# EAGLE design Deska 2 (EAGLE 5.06)
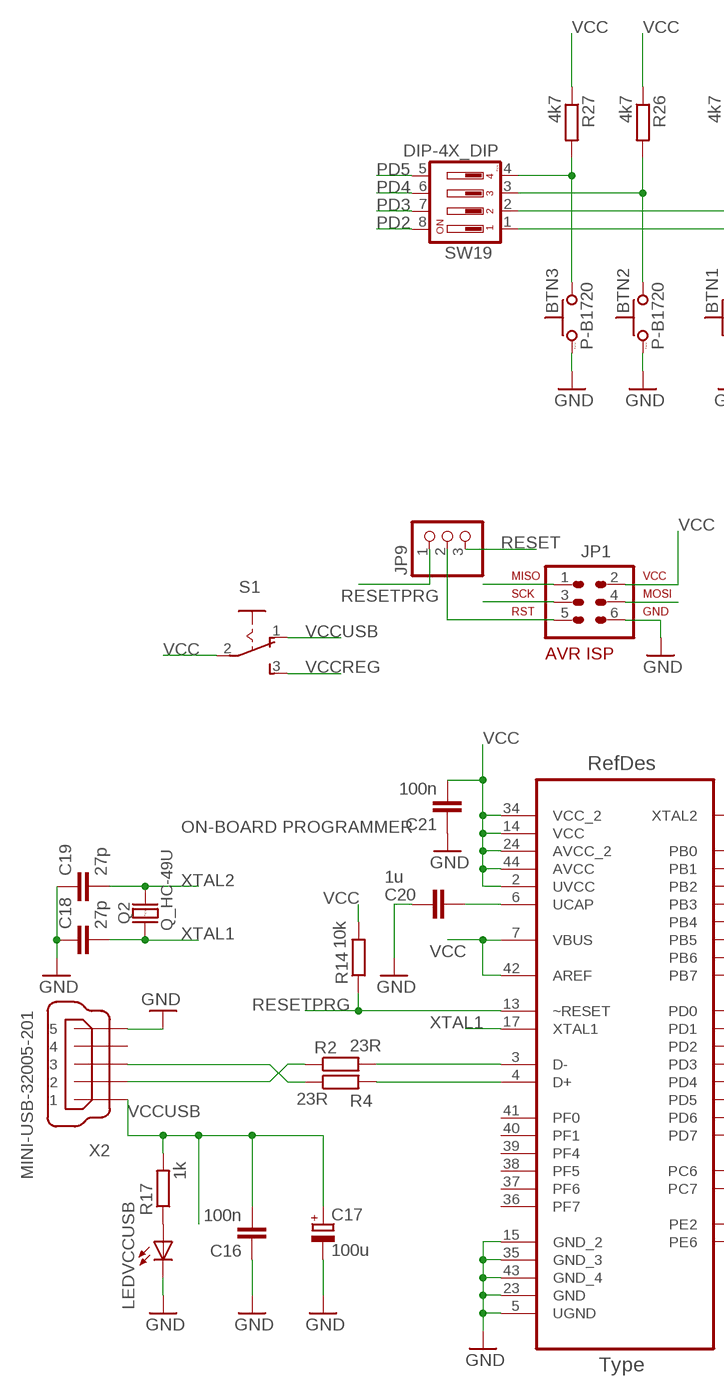
[diagram p0: schematic, sheet 1, part 1 of 2]
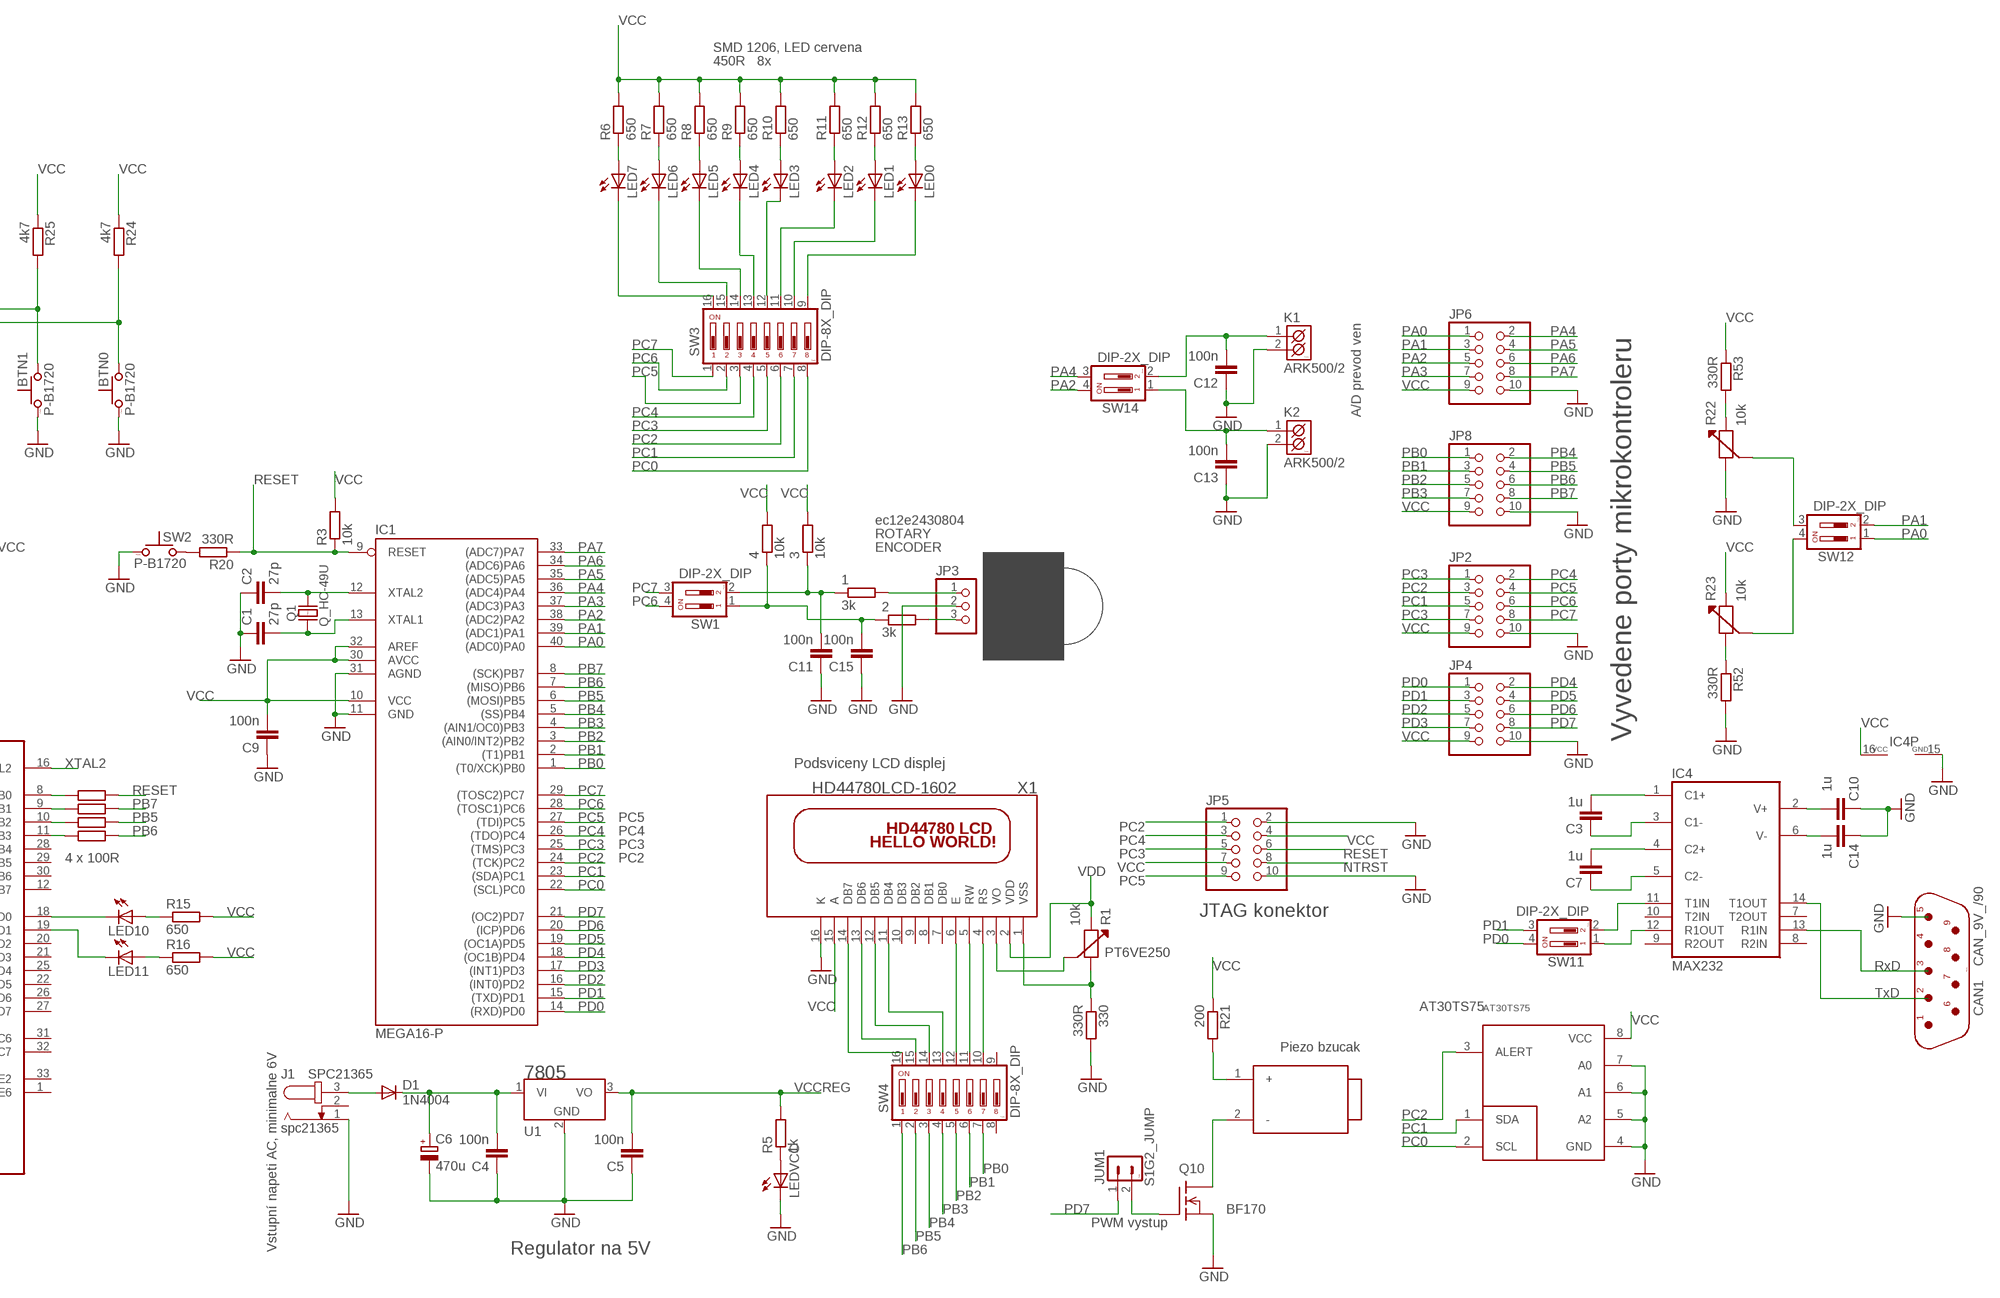
[diagram p1: schematic, sheet 1, part 2 of 2]

## Parts
1  3k  R-EU_M1206  [M1206]
2  3k  R-EU_M1206  [M1206]
3  10k  R-EU_M1206  [M1206]
4  10k  R-EU_M1206  [M1206]
5  100  R-EU_M1206  [M1206]
6  100  R-EU_M1206  [M1206]
7  100  R-EU_M1206  [M1206]
8  100  R-EU_M1206  [M1206]
330  330R  R-EU_M1206  [M1206]
BTN0  P-B1720  [P-B1720]
BTN1  P-B1720  [P-B1720]
BTN2  P-B1720  [P-B1720]
BTN3  P-B1720  [P-B1720]
C1  27p  C-EUC1206  [C1206]
C2  27p  C-EUC1206  [C1206]
C3  1u  C-EUC1206  [C1206]
C4  100n  C-EUC1206  [C1206]
C5  100n  C-EUC1206  [C1206]
C6  470u  CPOL-EUE2.5-7  [E2,5-7]
C7  1u  C-EUC1206  [C1206]
C9  100n  C-EUC1206  [C1206]
C10  1u  C-EUC1206  [C1206]
C11  100n  C-EUC1206  [C1206]
C12  100n  C-EUC1206  [C1206]
C13  100n  C-EUC1206  [C1206]
C14  1u  C-EUC1206  [C1206]
C15  100n  C-EUC1206  [C1206]
C16  100n  C-EUC1206  [C1206]
C17  100u  CPOL-EUE2.5-7  [E2,5-7]
C18  27p  C-EUC1206  [C1206]
C19  27p  C-EUC1206  [C1206]
C20  1u  C-EUC1206  [C1206]
C21  100n  C-EUC1206  [C1206]
CAN1  CAN_9V_/90  [CAN9V/90]
D1  1N4004  [DO41-10]
IC1  MEGA16-P  [DIL40]
IC4  MAX232  [DIL16]
J1  spc21365  JACK-PLUG1  [SPC4078]
JP1  AVR-ISP-6VERT  [AVR-ISP-6]
JP2  PINHD-2X5  [2X05]
JP3  PINHD-1X3  [1X03]
JP4  PINHD-2X5  [2X05]
JP5  PINHD-2X5  [2X05]
JP6  PINHD-2X5  [2X05]
JP8  PINHD-2X5  [2X05]
JP9  PINHD-1X3  [1X03]
JUM1  S1G2_JUMP  [S1G2_JUM]
K1  ARK500/2  [ARK500/2]
K2  ARK500/2  [ARK500/2]
KXG0905C  KXG0905C  [KXG0905C]
LED0  LEDSMT1206  [1206]
LED1  LEDSMT1206  [1206]
LED2  LEDSMT1206  [1206]
LED3  LEDSMT1206  [1206]
LED4  LEDSMT1206  [1206]
LED5  LEDSMT1206  [1206]
LED6  LEDSMT1206  [1206]
LED7  LEDSMT1206  [1206]
LED10  LEDSMT1206  [1206]
LED11  LEDSMT1206  [1206]
LEDVCC  LEDSMT1206  [1206]
LEDVCCUSB  LEDSMT1206  [1206]
Q1  Q_HC-49U  [HC-49U]
Q2  Q_HC-49U  [HC-49U]
Q10  BSS101  [TO92]
R1  10k  PT6V  [PT6V]
R2  23R  R-EU_M1206  [M1206]
R3  10k  R-EU_M1206  [M1206]
R4  23R  R-EU_M1206  [M1206]
R5  1k  R-EU_M1206  [M1206]
R6  650  R-EU_M1206  [M1206]
R7  650  R-EU_M1206  [M1206]
R8  650  R-EU_M1206  [M1206]
R9  650  R-EU_M1206  [M1206]
R10  650  R-EU_M1206  [M1206]
R11  650  R-EU_M1206  [M1206]
R12  650  R-EU_M1206  [M1206]
R13  650  R-EU_M1206  [M1206]
R14  10k  R-EU_M1206  [M1206]
R15  650  R-EU_M1206  [M1206]
R16  650  R-EU_M1206  [M1206]
R17  1k  R-EU_M1206  [M1206]
R20  330R  R-EU_M1206  [M1206]
R21  200  R-EU_M1206  [M1206]
R22  10k  PT6V  [PT6V]
R23  10k  PT6V  [PT6V]
R24  4k7  R-EU_M1206  [M1206]
R25  4k7  R-EU_M1206  [M1206]
R26  4k7  R-EU_M1206  [M1206]
R27  4k7  R-EU_M1206  [M1206]
R52  330R  R-EU_M1206  [M1206]
R53  330R  R-EU_M1206  [M1206]
S1  255SB  [255SB]
SW1  DIP-2X_DIP  [DIP-2X]
SW2  P-B1720  [P-B1720]
SW3  DIP-8X_DIP  [DIP-8X]
SW4  DIP-8X_DIP  [DIP-8X]
SW11  DIP-2X_DIP  [DIP-2X]
SW12  DIP-2X_DIP  [DIP-2X]
SW14  DIP-2X_DIP  [DIP-2X]
SW19  DIP-4X_DIP  [DIP-4X]
U1  7805  [TO-220S]
U2  ATMEGA16U4-AU  [QFP80P1200X1200X120-44N]
U$6  ATMEL_TEMP_SENSOR_AT30TS75  [SOIC8]
X1  HD44780LCD-1602  [LCD1602]
X2  MINI-USB-32005-201  [32005-201]

## Nets
GND: 330.2 BTN0.1 BTN1.1 BTN2.1 BTN3.1 C1.1 C2.1 C4.1 C5.1 C6.- C9.1 C10.1 C11.1 C12.1 C13.1 C14.1 C15.1 C16.1 C17.- C18.1 C19.1 C20.2 C21.1 CAN1.5 IC1.11(GND) IC1.31(AGND) IC4.15(GND) J1.1 JP1.6 JP2.10 JP3.2 JP4.10 JP5.2 JP5.10 JP6.10 JP8.10 K1.2(K2) K2.2(K2) LEDVCC.C LEDVCCUSB.C Q10.1(S) R22.1 R52.2 SW2.1 U1.2(GND) U2.5(UGND) U2.15(GND_2) U2.23(GND) U2.35(GND_3) U2.43(GND_4) U$6.4(GND) U$6.5(A2) U$6.6(A1) U$6.7(A0) X1.16(K) X2.5
N: JP1.5 JP9.2
N$1: R1.3 X1.3(VO)
N$2: C1.2 IC1.13(XTAL1) Q1.1
N$3: C2.2 IC1.12(XTAL2) Q1.2
N$4: SW4.16 X1.14(DB7)
N$5: SW4.15 X1.13(DB6)
N$6: SW4.14 X1.12(DB5)
N$7: SW4.13 X1.11(DB4)
N$8: SW4.12 X1.6(E)
N$9: SW4.11 X1.5(RW)
N$10: SW4.10 X1.4(RS)
N$11: 2.2 JP3.3
N$12: R2.2 U2.3(D-)
N$13: R2.1 X2.2
N$14: R4.1 X2.3
N$15: 2.1 4.1 C15.2 SW1.1
N$16: 1.1 3.1 C11.2 SW1.2
N$17: D1.A J1.3
N$18: C4.2 C6.+ D1.C U1.1(VI)
N$19: 1.2 JP3.1
N$20: R4.2 U2.4(D+)
N$21: LED10.C U2.18(PD0)
N$22: C20.1 U2.6(UCAP)
N$23: LED10.A R15.1
N$24: 5.1 U2.8(PB0)
N$25: 6.1 U2.9(PB1)
N$26: C12.2 K1.1(K1) SW14.2
N$27: LED11.A R16.1
N$28: LEDVCC.A R5.1
N$29: C13.2 K2.1(K1) SW14.1
N$30: LED3.C SW3.12
N$31: LED7.A R6.1
N$32: LED6.A R7.1
N$33: LED5.A R8.1
N$34: LED4.A R9.1
N$35: LED3.A R10.1
N$36: LED2.A R11.1
N$37: LED1.A R12.1
N$38: LED7.C SW3.16
N$39: LED6.C SW3.15
N$40: LED5.C SW3.14
N$41: LED4.C SW3.13
N$42: LED0.A R13.1
N$43: LED2.C SW3.11
N$44: LED1.C SW3.10
N$45: LED0.C SW3.9
N$46: IC4.12(R1OUT) SW11.1
N$47: C7.1 IC4.5(C2-)
N$48: C7.2 IC4.4(C2+)
N$49: C3.1 IC4.3(C1-)
N$50: C3.2 IC4.1(C1+)
N$51: C10.2 IC4.2(V+)
N$52: C14.2 IC4.6(V-)
N$53: BTN0.2 R24.2 SW19.1
N$54: BTN1.2 R25.2 SW19.2
N$55: BTN2.2 R26.2 SW19.3
N$56: BTN3.2 R27.2 SW19.4
N$57: R20.2 SW2.2
N$58: LED11.C U2.19(PD1)
N$59: 7.1 U2.10(PB2)
N$60: 8.1 U2.11(PB3)
N$61: LEDVCCUSB.A R17.1
N$63: U$6.3(ALERT)
N$114: JUM1.2 Q10.2(G)
N$116: KXG0905C.2(-) Q10.3(D)
N$120: KXG0905C.1(+) R21.2
N$122: IC4.11(T1IN) SW11.2
N$123: CAN1.2 IC4.14(T1OUT)
N$124: CAN1.3 IC4.13(R1IN)
N$125: R22.3 SW12.3
N$126: R23.3 SW12.4
N$131: R23.1 R52.1
N$132: R22.2 R53.2
NTRST: JP5.8
PA0: IC1.40((ADC0)PA0) JP6.1 SW12.1
PA1: IC1.39((ADC1)PA1) JP6.3 SW12.2
PA2: IC1.38((ADC2)PA2) JP6.5 SW14.4
PA3: IC1.37((ADC3)PA3) JP6.7
PA4: IC1.36((ADC4)PA4) JP6.2 SW14.3
PA5: IC1.35((ADC5)PA5) JP6.4
PA6: IC1.34((ADC6)PA6) JP6.6
PA7: IC1.33((ADC7)PA7) JP6.8
PB0: IC1.1((T0/XCK)PB0) JP8.1 SW4.7
PB1: IC1.2((T1)PB1) JP8.3 SW4.6
PB2: IC1.3((AIN0/INT2)PB2) JP8.5 SW4.5
PB3: IC1.4((AIN1/OC0)PB3) JP8.7 SW4.4
PB4: IC1.5((SS)PB4) JP8.2 SW4.3
PB5: 7.2 IC1.6((MOSI)PB5) JP1.4 JP8.4 SW4.2
PB6: 8.2 IC1.7((MISO)PB6) JP1.1 JP8.6 SW4.1
PB7: 6.2 IC1.8((SCK)PB7) JP1.3 JP8.8
PC0: IC1.22((SCL)PC0) JP2.7 SW3.8 U$6.2(SCL)
PC1: IC1.23((SDA)PC1) JP2.5 SW3.7 U$6.1(SDA)
PC2: IC1.24((TCK)PC2) JP2.3 JP5.1 SW3.6
PC3: IC1.25((TMS)PC3) JP2.1 JP5.5 SW3.5
PC4: IC1.26((TDO)PC4) JP2.2 JP5.3 SW3.4
PC5: IC1.27((TDI)PC5) JP2.4 JP5.9 SW3.3
PC6: IC1.28((TOSC1)PC6) JP2.6 SW1.4 SW3.2
PC7: IC1.29((TOSC2)PC7) JP2.8 SW1.3 SW3.1
PD0: IC1.14((RXD)PD0) JP4.1 SW11.4
PD1: IC1.15((TXD)PD1) JP4.3 SW11.3
PD2: IC1.16((INT0)PD2) JP4.5 SW19.8
PD3: IC1.17((INT1)PD3) JP4.7 SW19.7
PD4: IC1.18((OC1B)PD4) JP4.2 SW19.6
PD5: IC1.19((OC1A)PD5) JP4.4 SW19.5
PD6: IC1.20((ICP)PD6) JP4.6
PD7: IC1.21((OC2)PD7) JP4.8 JUM1.1
RESET: 5.2 IC1.9(RESET) JP5.6 JP9.3 R3.1 R20.1
RESETPRG: JP9.1 R14.1 U2.13(~RESET)
VCC: 3.2 4.2 C9.2 C21.2 IC1.10(VCC) IC1.30(AVCC) IC1.32(AREF) IC4.16(VCC) JP1.2 JP2.9 JP4.9 JP5.4 JP5.7 JP6.9 JP8.9 R3.2 R6.2 R7.2 R8.2 R9.2 R10.2 R11.2 R12.2 R13.2 R14.2 R15.2 R16.2 R21.1 R23.2 R24.1 R25.1 R26.1 R27.1 R53.1 S1.2(P) U2.2(UVCC) U2.7(VBUS) U2.14(VCC) U2.24(AVCC_2) U2.34(VCC_2) U2.42(AREF) U2.44(AVCC) U$6.8(VCC) X1.15(A)
VCCREG: C5.2 R5.2 S1.3(S) U1.3(VO)
VCCUSB: C16.2 C17.+ R17.2 S1.1(O) X2.1
VDD: R1.2 X1.2(VDD)
VSS: 330.1 R1.1 X1.1(VSS)
XTAL1: C18.2 Q2.1 U2.17(XTAL1)
XTAL2: C19.2 Q2.2 U2.16(XTAL2)
Unconnected: BTN0.3 BTN0.4 BTN1.3 BTN1.4 BTN2.3 BTN2.4 BTN3.3 BTN3.4 CAN1.1 CAN1.4 CAN1.6 CAN1.7 CAN1.8 CAN1.9 IC4.7(T2OUT) IC4.8(R2IN) IC4.9(R2OUT) IC4.10(T2IN) J1.2 SW2.3 SW2.4 SW4.8 SW4.9 U2.1(PE6) U2.12(PB7) U2.20(PD2) U2.21(PD3) U2.22(PD5) U2.25(PD4) U2.26(PD6) U2.27(PD7) U2.28(PB4) U2.29(PB5) U2.30(PB6) U2.31(PC6) U2.32(PC7) U2.33(PE2) U2.36(PF7) U2.37(PF6) U2.38(PF5) U2.39(PF4) U2.40(PF1) U2.41(PF0) X1.7(DB0) X1.8(DB1) X1.9(DB2) X1.10(DB3) X2.4

## Notes on the sheet
- SMD 1206, LED cervena
- 450R   8x
- A/D prevod ven
- ec12e2430804
- ROTARY
- ENCODER
- PC4
- PC5
- PC3
- Vyvedene porty mikrokontroleru
- Podsviceny LCD displej
- ON-BOARD PROGRAMMER
- PC5
- PC4
- PC3
- 4 x 100R | PC2
- JTAG konektor
- PT6VE250
- RxD
- TxD
- AT30TS75
- Vstupní napeti AC, minimalne 6V | Piezo bzucak
- SPC21365 | 7805
- BF170
- PWM vystup
- Regulator na 5V

## Library data of the parts
1-8 330 R2-R17 R20 R21 R24-R27 R52 R53 = resistor:R-EU_: RESISTOR, European symbol
BTN0 BTN1-BTN3 SW2 = #PaJa_prepinace:P-B1720: µ-tlacitko
C1-C5 C7 C9-C16 C18-C21 = resistor:C-EU: CAPACITOR, European symbol
C6 C17 = resistor:CPOL-EU: POLARIZED CAPACITOR, European symbol
CAN1 = #PaJa_konektory:CAN_9V: Konektory CANNON - vidlice - 9pinu
D1 = adafruit:1N4004: DIODE General purpose 1N400x type rectifier (With bigger pads) http://www.ladyada.net/library/pcb/eaglelibrary.html
IC1 = avr-7:MEGA16-P: MICROCONTROLLER 16 Kbytes FLASH 1 kbytes SRAM 512 bytes EEPROM USART 8-channel 10 bit ADC
IC4 = maxim:MAX232: RS232 TRANSEIVER
J1 = con-jack:JACK-PLUG: DC POWER JACK Power Jack, DC, Right Angle, Through Hole, Rated 5A at 16VDC, PC Terminals Distributor: Farnell (www.Farnell.de) Drawing: 84N1161.pdf / 84N1162.pdf Manufacturer: SPC Technology (www.spctechnology.com) Type: SPC4077 / SPC 4078
JP1 = avr-7:AVR-ISP-6: AVR ISP-6 Serial Programming Header
JP2 JP4-JP6 JP8 = pinhead:PINHD-2X5: PIN HEADER
JP3 JP9 = pinhead:PINHD-1X3: PIN HEADER
JUM1 = #PaJa_konektory:S1G2_JUMP: Radove konektory - koliky - 2x
K1 K2 = #PaJa_konektory:ARK500/2: Svorkovnice - roztec 5mm - dvojita
KXG0905C = piezo2:KXG0905C
LED0 LED1-LED7 LED10 LED11 LEDVCC LEDVCCUSB = led:LED: LED OSRAM: - CHIPLED LG R971, LG N971, LY N971, LG Q971, LY Q971, LO R971, LY R971 LH N974, LH R974 LS Q976, LO Q976, LY Q976 LO Q996 - Hyper CHIPLED LW Q18S LB Q993, LB Q99A, LB R99A - SideLED LS A670, LO A670, LY A670, LG A670, LP A670 LB A673, LV A673, LT A673, LW A673 LH A674 LY A675 LS A676, LA A676, LO A676, LY A676, LW A676 LS A679, LY A679, LG A679 - Hyper Micro SIDELED® LS Y876, LA Y876, LO Y876, LY Y876 LT Y87S - SmartLED LW L88C, LW L88S LB L89C, LB L89S, LG L890 LS L89K, LO L89K, LY L89K LS L896, LA L896, LO L896, LY L896 - TOPLED LS T670, LO T670, LY T670, LG T670, LP T670 LSG T670, LSP T670, LSY T670, LOP T670, LYG T670 LG T671, LOG T671, LSG T671 LB T673, LV T673, LT T673, LW T673 LH T674 LS T676, LA T676, LO T676, LY T676, LB T676, LH T676, LSB T676, LW T676 LB T67C, LV T67C, LT T67C, LS T67K, LO T67K, LY T67K, LW E67C LS E67B, LA E67B, LO E67B, LY E67B, LB E67C, LV E67C, LT E67C LW T67C LS T679, LY T679, LG T679 LS T770, LO T770, LY T770, LG T770, LP T770 LB T773, LV T773, LT T773, LW T773 LH T774 LS E675, LA E675, LY E675, LS T675 LS T776, LA T776, LO T776, LY T776, LB T776 LHGB T686 LT T68C, LB T68C - Hyper Mini TOPLED® LB M676 - Mini TOPLED Santana® LG M470 LS M47K, LO M47K, LY M47K Source: http://www.osram.convergy.de LUXEON: - LUMILED® LXK2-PW12-R00, LXK2-PW12-S00, LXK2-PW14-U00, LXK2-PW14-V00 LXK2-PM12-R00, LXK2-PM12-S00, LXK2-PM14-U00 LXK2-PE12-Q00, LXK2-PE12-R00, LXK2-PE12-S00, LXK2-PE14-T00, LXK2-PE14-U00 LXK2-PB12-K00, LXK2-PB12-L00, LXK2-PB12-M00, LXK2-PB14-N00, LXK2-PB14-P00, LXK2-PB14-Q00 LXK2-PR12-L00, LXK2-PR12-M00, LXK2-PR14-Q00, LXK2-PR14-R00 LXK2-PD12-Q00, LXK2-PD12-R00, LXK2-PD12-S00 LXK2-PH12-R00, LXK2-PH12-S00 LXK2-PL12-P00, LXK2-PL12-Q00, LXK2-PL12-R00 Source: www.luxeon.com KINGBRIGHT: KA-3528ASYC Source: www.kingbright.com
Q1 Q2 = #PaJa_22:Q_HC-49U: Krystal - 1MHz - 48MHz
Q10 = transistor-fet:BSS101: N-Channel Enhancement MOSFET 200V; 0,16A; 11Ohm
R1 R22 R23 = #_GM99:PT6V
S1 = switch:255SB: SLIDING SWITCH Distributor Buerklin, 11G810
SW1 SW11 SW12 SW14 = #PaJa_prepinace:DIP-2X: DIP Prepinac - 2x
SW3 SW4 = #PaJa_prepinace:DIP-8X: DIP Prepinac - 8x
SW19 = #PaJa_prepinace:DIP-4X: DIP Prepinac - 4x
U1 = #_GM99:7805
U2 = atmega16u4:ATMEGA16U4-AU; DESCRIPTION: Microcontroller with USB Controller; MPN: ATMEGA16U4-AU; OC_FARNELL: 1748521; OC_NEWARK: 26R5623; PACKAGE: TQFP-44; SUPPLIER: Atmel
U$6 = AT30TS75:ATMEL_TEMP_SENSOR_AT30TS75: Temperature sensor I2C
X1 = adafruit:HD44780LCD: HD44780 LCD Standard character type LCDs, available in sizes from 8x1 to 40x4!
X2 = con-cypressindustries:MINI-USB-: MINI USB-B Conector Source: www.cypressindustries.com

## Board
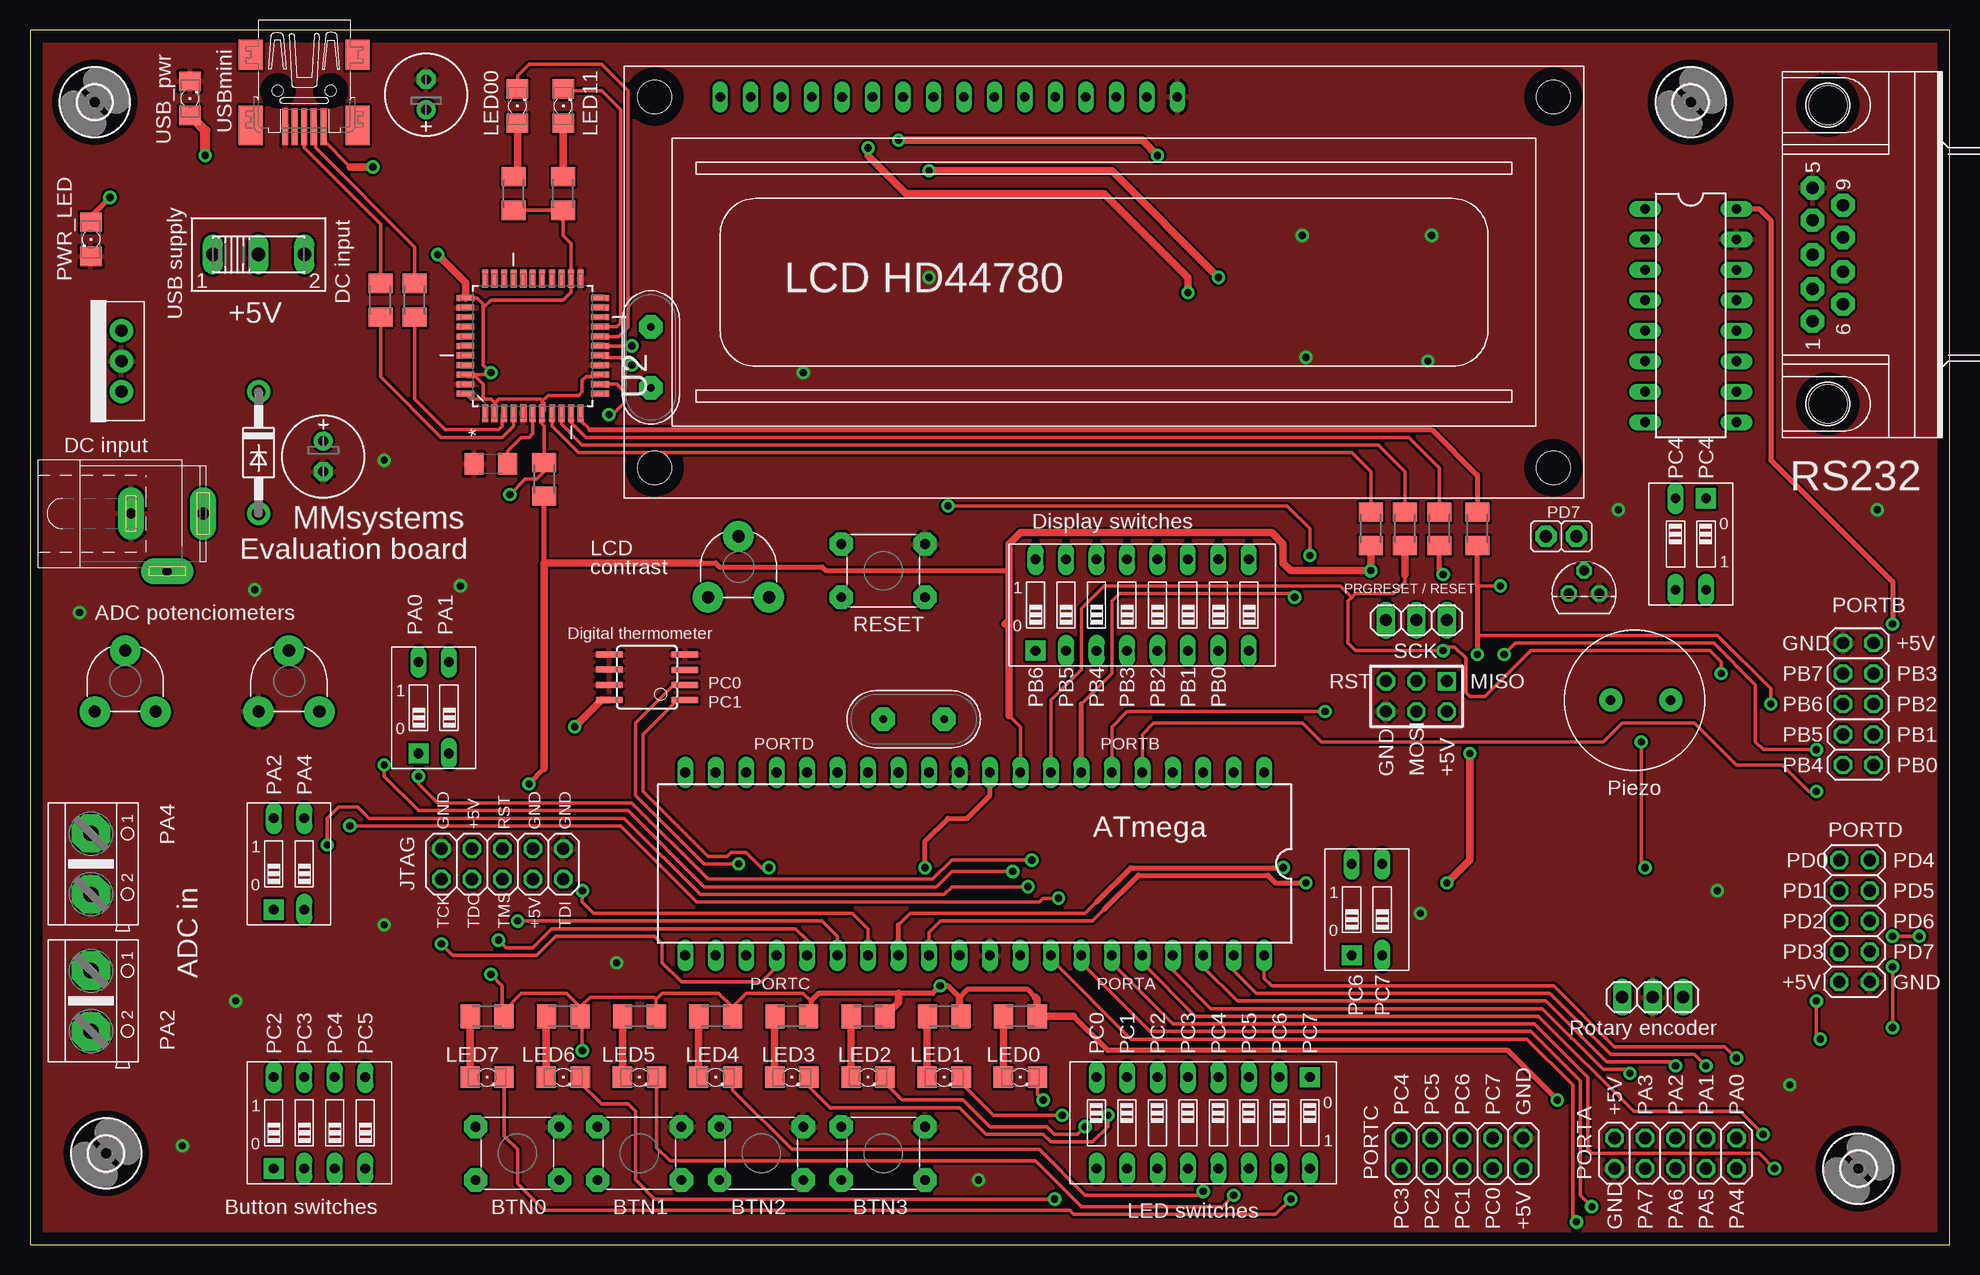
[diagram p2: board, top side]
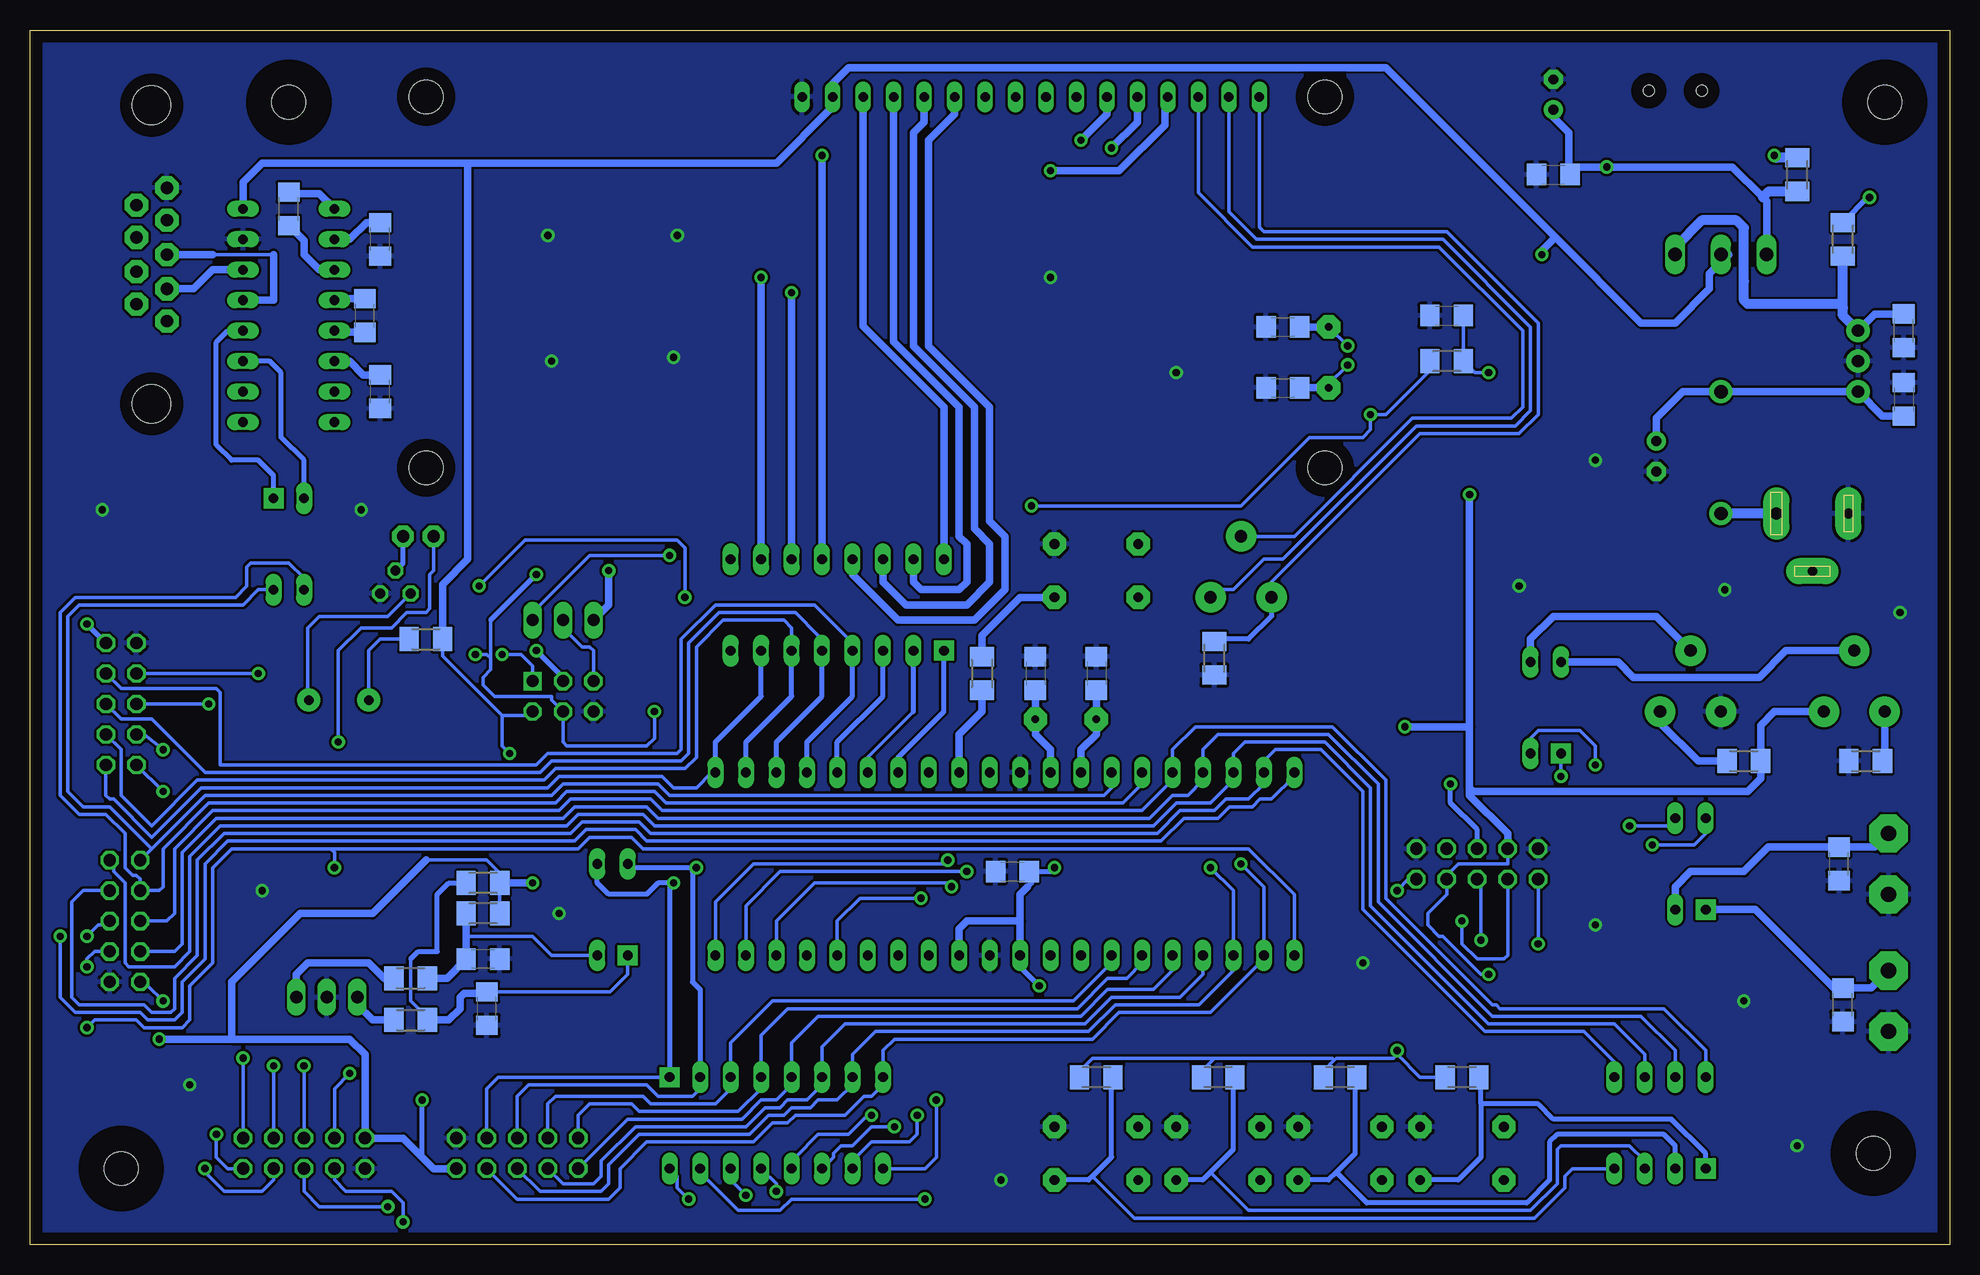
[diagram p3: board, bottom side, seen from below]

Size 160 x 101.27 mm. Coordinates in mm from the lower left corner, seen from the top.
Outline: 0,0 160,0 160,101.27 0,101.27 0,0
Copper layers (1*16): Top 0.035mm / dielectric 1.5mm / Bottom 0.035mm
Design rules "default *": minimum track width 10mil, minimum drill 24mil, track to track 8mil, track to pad 8mil, pad to pad 8mil, via to via 8mil, smd to smd 8mil, copper to edge 40mil, drill to drill 8mil, minimum pad ring 10mil, minimum via ring 10mil, stop-mask expansion 4mil, vias tented up to drill 0mil, thermal gap 10mil

### Footprints (pad centres in the part's own frame; a part is rotated, then mirrored left to right if it is on the bottom)
M1206 = smd 1.6 x 2: 1 -1.4,0; 2 1.4,0
P-B1720 = drill 0.813 pad 1.93 octagon: 1 -3.493,-2.223; 2 -3.493,2.223; 3 3.493,-2.223; 4 3.493,2.223
C1206 = smd 1.6 x 1.8: 1 -1.4,0; 2 1.4,0
E2,5-7 = drill 0.813 pad 1.6 round: + -1.27,0 | drill 0.813 pad 1.6 octagon: - 1.27,0
CAN9V/90 = drill 1.016 pad 1.93 octagon: 1 5.556,0; 2 2.857,0; 3 0,0; 4 -2.857,0; 5 -5.556,0; 6 4.128,2.54; 7 1.429,2.54; 8 -1.429,2.54; 9 -4.128,2.54 | hole 3.2: 12.446,1.27; -12.446,1.27
DO41-10 = drill 1.118 pad 1.93 round: A 5.08,0; C -5.08,0
DIL40 = drill 0.813 long: 1 -24.13,-7.62; 2 -21.59,-7.62; 3 -19.05,-7.62; 4 -16.51,-7.62; 5 -13.97,-7.62; 6 -11.43,-7.62; 7 -8.89,-7.62; 8 -6.35,-7.62; 9 -3.81,-7.62; 10 -1.27,-7.62; 11 1.27,-7.62; 12 3.81,-7.62; 13 6.35,-7.62; 14 8.89,-7.62; 15 11.43,-7.62; 16 13.97,-7.62; 17 16.51,-7.62; 18 19.05,-7.62; 19 21.59,-7.62; 20 24.13,-7.62; 21 24.13,7.62; 22 21.59,7.62; 23 19.05,7.62; 24 16.51,7.62; 25 13.97,7.62; 26 11.43,7.62; 27 8.89,7.62; 28 6.35,7.62; 29 3.81,7.62; 30 1.27,7.62; 31 -1.27,7.62; 32 -3.81,7.62; 33 -6.35,7.62; 34 -8.89,7.62; 35 -11.43,7.62; 36 -13.97,7.62; 37 -16.51,7.62; 38 -19.05,7.62; 39 -21.59,7.62; 40 -24.13,7.62
DIL16 = drill 0.813 long: 1 -8.89,-3.81; 2 -6.35,-3.81; 3 -3.81,-3.81; 4 -1.27,-3.81; 5 1.27,-3.81; 6 3.81,-3.81; 7 6.35,-3.81; 8 8.89,-3.81; 9 8.89,3.81; 10 6.35,3.81; 11 3.81,3.81; 12 1.27,3.81; 13 -1.27,3.81; 14 -3.81,3.81; 15 -6.35,3.81; 16 -8.89,3.81
SPC4078 = drill 0.8 pad 2.184 long: 1 -3,0; 2 0,-4.8 | drill 1 pad 2.184 long: 3 3,0
AVR-ISP-6 = drill 1.016 square: 1 -2.54,-1.27 | drill 1.016 octagon: 2 -2.54,1.27; 3 0,-1.27; 4 0,1.27; 5 2.54,-1.27; 6 2.54,1.27
2X05 = drill 1.016 octagon: 1 -5.08,-1.27; 2 -5.08,1.27; 3 -2.54,-1.27; 4 -2.54,1.27; 5 0,-1.27; 6 0,1.27; 7 2.54,-1.27; 8 2.54,1.27; 9 5.08,-1.27; 10 5.08,1.27
1X03 = drill 1.016 long: 1 -2.54,0; 2 0,0; 3 2.54,0
S1G2_JUM = drill 1.016 pad 1.778 octagon: 1 -1.27,0; 2 1.27,0
ARK500/2 = drill 1.27 pad 3.2 octagon: 1 -2.54,0; 2 2.54,0
KXG0905C = drill 0.8 pad 1.93 round: 1 0,0; 2 5,0
1206 = smd 1.6 x 1.803: A -1.422,0; C 1.422,0
HC-49U = drill 0.61 pad 1.93 octagon: 1 -2.54,0; 2 2.54,0
TO92 = drill 0.813 octagon: 1 1.27,0; 2 0,1.905; 3 -1.27,0
PT6V = drill 1.016 pad 2.54 round: 1 0,0; 2 5.08,0; 3 2.54,5.08
255SB = drill 1.118 long: 1 -3.81,0; 2 0,0; 3 3.81,0
DIP-2X = drill 0.813 pad 1.676 square: 1 -1.27,-3.81 | drill 0.813 pad 1.27 long: 2 1.27,-3.81; 3 1.27,3.81; 4 -1.27,3.81
DIP-8X = drill 0.813 pad 1.676 square: 1 -8.89,-3.81 | drill 0.813 pad 1.27 long: 2 -6.35,-3.81; 3 -3.81,-3.81; 4 -1.27,-3.81; 5 1.27,-3.81; 6 3.81,-3.81; 7 6.35,-3.81; 8 8.89,-3.81; 9 8.89,3.81; 10 6.35,3.81; 11 3.81,3.81; 12 1.27,3.81; 13 -1.27,3.81; 14 -3.81,3.81; 15 -6.35,3.81; 16 -8.89,3.81
DIP-4X = drill 0.813 pad 1.676 square: 1 -3.81,-3.81 | drill 0.813 pad 1.27 long: 2 -1.27,-3.81; 3 1.27,-3.81; 4 3.81,-3.81; 5 3.81,3.81; 6 1.27,3.81; 7 -1.27,3.81; 8 -3.81,3.81
TO-220S = drill 1.016 pad 1.93 round: 1 0,0; 2 2.54,0; 3 5.08,0
QFP80P1200X1200X120-44N = smd 1.473 x 0.508: 1 -5.613,3.988; 2 -5.613,3.2; 3 -5.613,2.388; 4 -5.613,1.6; 5 -5.613,0.787; 6 -5.613,0; 7 -5.613,-0.787; 8 -5.613,-1.6; 9 -5.613,-2.388; 10 -5.613,-3.2; 11 -5.613,-3.988; 23 5.613,-3.988; 24 5.613,-3.2; 25 5.613,-2.388; 26 5.613,-1.6; 27 5.613,-0.787; 28 5.613,0; 29 5.613,0.787; 30 5.613,1.6; 31 5.613,2.388; 32 5.613,3.2; 33 5.613,3.988 | smd 0.508 x 1.473: 12 -3.988,-5.613; 13 -3.2,-5.613; 14 -2.388,-5.613; 15 -1.6,-5.613; 16 -0.787,-5.613; 17 0,-5.613; 18 0.787,-5.613; 19 1.6,-5.613; 20 2.388,-5.613; 21 3.2,-5.613; 22 3.988,-5.613; 34 3.988,5.613; 35 3.2,5.613; 36 2.388,5.613; 37 1.6,5.613; 38 0.787,5.613; 39 0,5.613; 40 -0.787,5.613; 41 -1.6,5.613; 42 -2.388,5.613; 43 -3.2,5.613; 44 -3.988,5.613
2,8 = hole 2.8: 0,0
SOIC8 = smd 0.5 x 2.2: 1 -1.905,-3.154; 2 -0.645,-3.154; 3 0.625,-3.154; 4 1.895,-3.154; 5 1.905,3.154; 6 0.635,3.154; 7 -0.635,3.154; 8 -1.905,3.154
LCD1602 = drill 0.8 long: 1 8,33.46; 2 10.54,33.46; 3 13.08,33.46; 4 15.62,33.46; 5 18.16,33.46; 6 20.7,33.46; 7 23.24,33.46; 8 25.78,33.46; 9 28.32,33.46; 10 30.86,33.46; 11 33.4,33.46; 12 35.94,33.46; 13 38.48,33.46; 14 41.02,33.46; 15 43.56,33.46; 16 46.1,33.46 | hole 2.8: 2.54,2.54; 2.54,33.46; 77.46,33.46; 77.46,2.54
32005-201 = smd 3.1 x 0.5: 1 3,1.6; 2 3,0.8; 3 3,0; 4 3,-0.8; 5 3,-1.6 | smd 2.5 x 2: M1 -3,-4.45; M2 -3,4.45 | smd 3.3 x 2: M3 2.9,4.45; M4 2.9,-4.45 | hole 0.9: 0,2.2; 0,-2.2

### Placement (x,y rotation side)
1  128.27,22.23 180 bottom
2  128.27,18.73 180 bottom
3  122.24,27.62 0 bottom
4  122.24,30.16 0 bottom
5  111.76,59.69 270 top
6  114.62,59.69 270 top
7  117.47,59.69 270 top
8  120.65,59.69 270 top
330  61.28,48.9 270 bottom
BTN0  40.64,7.62 180 top
BTN1  50.8,7.62 180 top
BTN2  60.96,7.62 180 top
BTN3  71.12,7.62 180 top
C1  71.12,47.62 270 bottom
C2  76.2,47.62 270 bottom
C3  138.43,86.36 90 bottom
C4  3.81,70.48 270 bottom
C5  3.81,76.2 90 bottom
C6  24.45,65.72 270 top
C7  132.08,77.47 90 bottom
C9  78.11,31.11 0 bottom
C10  130.81,83.82 90 bottom
C11  122.24,23.81 180 bottom
C12  9.21,31.75 90 bottom
C13  8.89,20 90 bottom
C14  130.81,71.12 90 bottom
C15  121.92,19.68 90 bottom
C16  33.02,89.22 0 bottom
C17  33.02,95.89 90 top
C18  55.56,76.52 0 bottom
C19  55.56,71.44 0 bottom
C20  38.42,65.09 180 top
C21  41.91,77.47 0 bottom
CAN1  148.59,82.55 270 top
D1  19.05,66.04 270 top
IC1  78.74,31.75 180 top
IC4  138.43,77.47 270 top
J1  11.43,60.96 0 top
JP1  115.57,45.72 180 top
JP2  119.38,7.62 0 top
JP3  135.25,20.64 180 top
JP4  152.08,26.99 270 top
JP5  39.37,31.75 0 top
JP6  137.16,7.62 180 top
JP8  152.4,45.09 90 top
JP9  115.57,52.07 180 top
JUM1  127.64,59.05 0 top
K1  5.08,31.75 270 top
K2  5.08,20.32 270 top
KXG0905C  131.76,45.4 0 top
LED0  82.55,13.97 0 top
LED1  76.2,13.97 0 top
LED2  69.85,13.97 0 top
LED3  63.5,13.97 0 top
LED4  57.15,13.97 0 top
LED5  50.8,13.97 0 top
LED6  44.45,13.97 0 top
LED7  38.1,13.97 0 top
LED10  40.64,94.93 90 top
LED11  44.45,94.93 90 top
LEDVCC  5.08,83.82 270 top
LEDVCCUSB  13.34,95.57 90 top
Q1  73.66,43.81 0 top
Q2  51.75,73.98 270 top
Q10  129.54,54.29 0 top
R1  56.52,53.98 0 top
R2  32.07,78.74 270 top
R3  42.86,63.82 90 top
R4  29.21,78.74 270 top
R5  8.89,83.82 270 bottom
R6  38.1,19.05 0 top
R7  44.45,19.05 0 top
R8  50.8,19.05 0 top
R9  57.15,19.05 0 top
R10  63.5,19.05 0 top
R11  69.85,19.05 0 top
R12  76.2,19.05 0 top
R13  82.55,19.05 0 top
R14  41.91,73.66 0 bottom
R15  40.32,87.63 270 top
R16  44.45,87.63 270 top
R17  12.7,89.22 270 bottom
R20  80.64,47.62 90 bottom
R21  127,50.48 180 bottom
R22  19.05,44.45 0 top
R23  5.4,44.45 0 top
R24  40.64,13.97 0 bottom
R25  50.8,13.97 0 bottom
R26  60.96,13.97 0 bottom
R27  71.12,13.97 0 bottom
R52  6.99,40.32 180 bottom
R53  17.14,40.32 180 bottom
S1  19.05,82.55 0 top
SW1  111.44,27.94 0 top
SW2  71.12,56.2 180 top
SW3  97.79,10.16 180 top
SW4  92.71,53.34 0 top
SW11  138.43,58.42 180 top
SW12  33.66,44.77 0 top
SW14  21.59,31.75 0 top
SW19  24.13,10.16 0 top
U1  7.62,71.12 90 top
U2  41.91,74.93 90 top
U$2  [2,8]  138.43,95.25 0 top
U$3  [2,8]  152.4,6.35 0 top
U$4  [2,8]  6.35,7.62 0 top
U$5  [2,8]  5.4,95.25 0 top
U$6  51.44,47.31 90 top
X1  49.53,62.23 0 top
X2  22.86,96.2 270 top

### Tracks (layer width: path | path; a pad name or v marks a point on that pad's centre or on a via)
GND  (via drill 0.6)
  other vias: 29.53,65.41 35.88,54.93 18.73,54.61 4.13,52.7 29.53,26.67 17.14,20.32 12.7,8.26 48.9,23.5 79.06,5.4 115.89,27.62 146.69,13.34 140.65,29.53 132.4,61.28 153.99,61.28 116.84,84.14 106.05,84.14 106.36,73.98 116.52,73.66 74.93,80.64 64.45,72.71
  pour Top: 0,0 160.02,0 160.02,101.28 0,101.28
  pour Bottom: 0,0 160.02,0 160.02,101.28 0,101.28
N
  Bottom 0.305: JP9.2 115.57,51.44 113.98,49.85 113.35,49.85 113.03,49.53 JP1.5
N$1
  Bottom 0.305: X1.3 62.61,87.69 58.1,83.19 42.55,83.19 35.56,76.2 35.56,69.85 36.51,68.9 44.77,68.9 54.61,59.05 R1.3
N$2
  Bottom 0.61: IC1.13 72.39,41.27 71.12,42.55 Q1.1 C1.2
N$3
  Bottom 0.61: IC1.12 74.93,41.27 76.2,42.55 Q1.2 C2.2
N$4
  Bottom 0.61: X1.14 90.55,76.58 83.82,69.85 SW4.16
N$5
  Bottom 0.61: X1.13 88.01,75.31 82.55,69.85 82.55,59.05 81.92,58.42 81.92,55.24 82.55,54.61 85.72,54.61 86.36,55.24 SW4.15
N$6
  Bottom 0.61: X1.12 85.47,93.6 86.36,92.71 86.36,74.93 81.28,69.85 81.28,59.69 80.01,58.42 80.01,55.24 81.92,53.34 87,53.34 88.9,55.24 SW4.14
N$7
  Bottom 0.61: X1.11 82.93,94.23 85.09,92.08 85.09,74.93 80.01,69.85 80.01,60.33 78.74,59.05 78.74,54.61 81.28,52.07 87.63,52.07 91.44,55.88 SW4.13
N$8  (via drill 0.6 pad 0.41)
  Top 0.61: v93.98,90.81 92.71,92.08 v72.39,92.08
  Bottom 0.61: SW4.12 v93.98,90.81 | v72.39,92.08 70.23,94.23 X1.6
N$9  (via drill 0.6 pad 0.41)
  Top 0.61: v96.52,79.38 96.52,80.64 89.53,87.63 73.03,87.63 69.85,90.81 v69.85,91.44
  Bottom 0.61: SW4.11 v96.52,79.38 | v69.85,91.44 67.69,93.6 X1.5
N$10  (via drill 0.6 pad 0.41)
  Top 0.61: v99.06,80.64 90.17,89.53 v74.93,89.53
  Bottom 0.61: SW4.10 v99.06,80.64 | v74.93,89.53 69.22,89.53 65.41,93.34 65.41,95.44 X1.4
N$11
  Bottom 0.61: 2.2 131.44,18.73 132.72,20 JP3.3
N$12
  Top 0.305: R2.2 32.07,70.48 34.61,67.94 39.05,67.94 39.37,68.26 39.37,69.16 U2.3
N$13
  Top 0.305: X2.2 23.81,93.37 23.81,91.44 32.07,83.19 R2.1
N$14
  Top 0.305: X2.3 22.86,91.44 29.21,85.09 R4.1
N$15
  Bottom 0.305: 2.1 126.87,18.92 128.27,20.32 128.27,23.81 | C15.2 111.63,21.09 110.17,22.54 SW1.1
  Bottom 0.406: 128.27,23.81 127.64,24.45 126.05,24.45 126.05,29.21 125.09,30.16 4.1
  Bottom 0.61: 2.1 125.09,18.73 124.14,19.68 124.14,20.64 123.83,20.95 122.05,20.95 C15.2
N$16
  Bottom 0.305: C11.2 123.64,24.95 123.51,25.08 | SW1.2 116.52,24.13 118.11,25.72 123.64,25.72
  Bottom 0.61: 1.1 125.22,22.23 C11.2 123.64,25.72 3.1
N$17
  Bottom 0.813: J1.3 D1.A
N$18
  Bottom 0.61: C4.2 5.58,69.08 U1.1 D1.C 22.23,71.12 24.45,68.9 C6.+
N$19
  Bottom 0.61: 1.2 130.49,22.23 131.76,23.5 136.84,23.5 137.79,22.54 JP3.1
N$20
  Top 0.305: R4.2 29.21,72.39 34.29,67.31 39.37,67.31 40.32,68.26 40.32,69.3 U2.4
N$21
  Top 0.305: U2.18 49.05,75.72 49.85,76.52 49.85,96.2 47.62,98.42 41.59,98.42 40.64,97.47 LED10.C
N$22
  Top 0.305: C20.1 39.82,66.17 40.96,67.31 41.59,67.31 41.91,67.63 U2.6
N$23
  Top 0.61: LED10.A 40.64,89.35 R15.1
N$24
  Top 0.305: U2.8 43.51,68.25 45.72,66.04 110.17,66.04 111.76,64.45 5.1
N$25
  Top 0.305: U2.9 44.3,68.42 46.04,66.67 112.39,66.67 114.62,64.45 6.1
N$26
  Bottom 0.61: K1.1 6.22,33.15 C12.2 15.11,33.15 17.14,31.11 21.59,31.11 22.86,29.84 SW14.2
N$27
  Top 0.61: R16.1 LED11.A
N$28  (via drill 0.6 pad 0.41)
  Top 0.406: LEDVCC.A 5.08,85.72 v6.67,87.31
  Bottom 0.406: v6.67,87.31 6.8,87.31 R5.1
N$29
  Bottom 0.61: K2.1 6.54,21.4 C13.2 9.65,21.4 16.19,27.94 SW14.1
N$30  (via drill 0.6)
  Top 0.305: LED3.C 64.92,13.18 66.67,11.43 77.47,11.43 79.69,9.21 84.45,9.21 85.09,8.57 88.58,8.57 89.85,9.84 v89.85,10.79
  Bottom 0.305: v89.85,10.79 90.17,10.79 91.76,9.21 94.3,9.21 96.2,7.3 96.2,6.67 SW3.12
N$31
  Top 0.61: R6.1 36.68,19.03 LED7.A
N$32
  Top 0.61: R7.1 43.03,19.03 LED6.A
N$33
  Top 0.61: R8.1 49.38,19.03 LED5.A
N$34
  Top 0.61: R9.1 55.73,19.03 LED4.A
N$35
  Top 0.61: R10.1 62.08,19.03 LED3.A
N$36
  Top 0.61: R11.1 68.43,19.03 LED2.A
N$37
  Top 0.61: R12.1 74.78,19.03 LED1.A
N$38  (via drill 0.6)
  Top 0.305: LED7.C 39.52,9.06 40.64,7.94 40.64,5.08 42.86,2.86 86.68,2.86 87,2.54 103.82,2.54 v105.09,3.81
  Bottom 0.305: v105.09,3.81 106.05,4.76 106.05,5.71 SW3.16
N$39  (via drill 0.6)
  Top 0.305: LED6.C 45.87,13.5 47.62,11.75 49.85,11.75 50.48,11.11 50.48,5.4 52.07,3.81 v85.41,3.81
  Bottom 0.305: v85.41,3.81 96.52,3.81 97.47,2.86 100.97,2.86 103.82,5.71 103.82,6.03 SW3.15
N$40  (via drill 0.6)
  Top 0.305: LED5.C 52.22,8.1 53.34,6.99 83.82,6.99 87.63,3.17 99.38,3.17 v100.33,4.13
  Bottom 0.305: v100.33,4.13 101.6,5.4 SW3.14
N$41  (via drill 0.6)
  Top 0.305: LED4.C 58.57,12.87 63.5,7.94 84.14,7.94 87.95,4.13 97.47,4.13 v97.79,4.45
  Bottom 0.305: v97.79,4.45 97.79,5.08 SW3.13
N$42
  Top 0.61: LED0.A 81.15,13.99 R13.1
N$43  (via drill 0.6)
  Top 0.305: LED2.C 71.27,13.5 72.71,12.06 77.79,12.06 80.01,9.84 84.77,9.84 85.41,9.21 87.31,9.21 v87.95,9.84
  Bottom 0.305: v87.95,9.84 89.85,9.84 91.44,8.26 92.39,8.26 93.03,7.62 93.03,7.3 SW3.11
N$44  (via drill 0.6)
  Top 0.305: LED1.C 77.62,13.5 80.33,10.79 v86.04,10.79
  Bottom 0.305: v86.04,10.79 86.04,9.21 86.68,8.57 89.85,8.57 91.44,6.99 SW3.10
N$45  (via drill 0.6)
  Top 0.305: LED0.C 83.97,12.55 v84.45,12.06
  Bottom 0.305: v84.45,12.06 84.45,7.3 85.41,6.35 SW3.9
N$46
  Bottom 0.406: IC4.12 143.51,76.2 144.46,75.25 144.46,66.67 143.19,65.41 140.97,65.41 139.7,64.14 SW11.1
N$47
  Bottom 0.61: C7.1 134.49,76.07 IC4.5
N$48
  Bottom 0.61: C7.2 134.49,78.87 IC4.4
N$49
  Bottom 0.61: IC4.3 135.89,81.28 137.16,82.55 137.16,83.69 C3.1
N$50
  Bottom 0.61: IC4.1 135.89,87.63 138.3,87.63 C3.2
N$51
  Bottom 0.61: C10.2 131.95,85.22 133.35,83.82 IC4.2
N$52
  Bottom 0.61: C14.2 132.21,72.52 133.35,73.66 IC4.6
N$53
  Bottom 0.406: BTN0.2 40.96,5.4 39.05,7.3 39.05,11.75 | 39.05,11.75 39.05,13.78 R24.2 | SW19.1 20.32,7.62 23.18,10.48 33.02,10.48 34.29,11.75 39.05,11.75
N$54
  Bottom 0.406: BTN1.2 51.75,5.4 51.12,6.03 | 51.12,6.03 49.53,7.62 49.53,13.84 R25.2 | SW19.2 22.86,8.26 23.81,9.21 32.7,9.21 33.34,8.57 33.34,5.4 35.24,3.49 48.58,3.49 51.12,6.03
N$55
  Bottom 0.305: SW19.3 25.4,6.99 26.67,8.26 32.38,8.26 32.7,7.94 32.7,5.08 34.92,2.86 58.42,2.86 61.59,6.03
  Bottom 0.406: BTN2.2 62.23,5.4 61.59,6.03 59.69,7.94 59.69,13.84 R26.2
N$56
  Bottom 0.305: SW19.4 31.43,6.35 32.07,5.71 32.07,4.76 34.61,2.22 67.94,2.22 71.44,5.71
  Bottom 0.406: BTN3.2 71.75,5.4 71.44,5.71 69.85,7.3 69.85,13.84 R27.2
N$57
  Bottom 0.61: SW2.2 77.47,53.98 80.64,50.8 R20.2
N$58
  Top 0.305: U2.19 48.91,76.53 49.21,76.83 49.21,94.61 47.62,96.2 44.6,96.2 LED11.C
N$59
  Top 0.305: U2.10 45.11,68.56 46.35,67.31 114.94,67.31 117.47,64.77 7.1
N$60
  Top 0.305: U2.11 45.9,68.72 46.67,67.94
  Top 0.406: 46.67,67.94 116.84,67.94 120.65,64.14 8.1
N$61  (via drill 0.6)
  Top 0.813: v14.61,90.81 14.61,92.88 LEDVCCUSB.A
  Bottom 0.813: R17.1 14.42,90.62 v14.61,90.81
N$114
  Bottom 0.406: JUM1.2 128.91,56.83 Q10.2
N$116
  Bottom 0.305: Q10.3 130.18,52.39 135.89,52.39 136.84,51.44 136.84,45.48 KXG0905C.2
N$120
  Bottom 0.305: R21.2 130.81,50.48 131.76,49.53 KXG0905C.1
N$122
  Bottom 0.406: IC4.11 140.02,73.66 139.06,72.71 139.06,67.31 137.16,65.41 SW11.2
N$123
  Bottom 0.61: CAN1.2 146.37,79.69 144.78,81.28 IC4.14
N$124
  Bottom 0.305: 139.7,82.55 144.78,82.55
  Bottom 0.61: 144.78,82.55 CAN1.3 | 139.7,82.55 139.7,78.74 IC4.13
N$125
  Bottom 0.61: R22.3 24.45,52.39 33.02,52.39 34.92,50.48 SW12.3
N$126
  Bottom 0.61: R23.3 13.65,49.53 15.88,47.31 26.35,47.31 27.62,48.58 SW12.4
N$131
  Bottom 0.61: R23.1 5.4,40.51 R52.1
N$132
  Bottom 0.61: R53.2 20.95,40.32 24.13,43.5 R22.2
PA0  (via drill 0.6)
  Top 0.305: IC1.40 102.87,22.23 103.5,21.59 127,21.59 132.08,16.51 141.29,16.51 v142.24,15.56 | v83.5,32.07 76.83,32.07 75.25,30.48 56.52,30.48 50.16,36.83 33.97,36.83 32.38,38.42 v32.38,39.05
  Bottom 0.305: v142.24,15.56 JP6.1 | IC1.40 102.87,28.57 99.69,31.75 83.82,31.75 v83.5,32.07 | v32.38,39.05 SW12.1
PA1  (via drill 0.6)
  Top 0.305: IC1.39 100.33,22.86 102.23,20.95 126.68,20.95 131.76,15.88 138.75,15.88 v139.7,14.92 | v81.92,31.11 76.83,31.11 75.56,29.84 56.2,29.84 49.85,36.2 32.38,36.2 29.53,39.05 v29.53,40.01
  Bottom 0.305: v139.7,14.92 JP6.3 | IC1.39 100.33,28.26 97.47,31.11 v81.92,31.11 | v29.53,40.01 29.53,41.59 30.8,42.86 34.29,42.86 34.92,42.23 SW12.2
PA2  (via drill 0.6)
  Top 0.305: IC1.38 97.79,23.18 100.65,20.32 126.36,20.32 131.44,15.24 136.84,15.24 v137.16,14.92 | v83.19,29.84 76.83,29.84 76.2,29.21 55.88,29.21 49.53,35.56 28.26,35.56 27.3,36.51 25.72,36.51 24.77,35.56 v24.77,33.34
  Bottom 0.305: v137.16,14.92 JP6.5 | IC1.38 97.79,26.99 94.61,30.16 83.5,30.16 v83.19,29.84 | v24.77,33.34 21.27,33.34 20.32,34.29 SW14.4
PA3  (via drill 0.6)
  Top 0.305: IC1.37 95.25,22.86 98.42,19.68 126.05,19.68 131.13,14.61 133.03,14.61 v133.35,14.29
  Bottom 0.305: JP6.7 134.62,13.02 v133.35,14.29
PA4  (via drill 0.6)
  Top 0.305: IC1.36 92.71,23.5 97.16,19.05 125.73,19.05 133.67,11.11 142.56,11.11 v144.46,9.21 | v85.72,28.89 84.45,28.89 84.14,28.57 55.56,28.57 49.21,34.92 v26.67,34.92
  Bottom 0.305: v144.46,9.21 144.46,7.3 143.51,6.35 JP6.2 | IC1.36 92.71,26.99 90.81,28.89 v85.72,28.89 | v26.67,34.92 23.5,34.92 SW14.3
PA5  (via drill 0.6)
  Top 0.305: IC1.35 90.17,23.5 95.25,18.41 125.41,18.41 129.86,13.97 129.86,7.94 130.18,7.62 144.15,7.62 v145.41,6.35
  Bottom 0.305: v145.41,6.35 145.41,6.03 143.83,4.45 140.65,4.45 139.7,5.4 JP6.4
PA6  (via drill 0.6)
  Top 0.305: IC1.34 87.63,23.5 93.34,17.78 125.09,17.78 129.22,13.65 129.22,4.13 v130.18,3.17
  Bottom 0.305: v130.18,3.17 135.89,3.17 137.16,4.45 JP6.6
PA7  (via drill 0.6)
  Top 0.305: IC1.33 85.09,23.81 91.76,17.14 124.78,17.14 128.59,13.34 128.59,2.22 v128.91,1.91
  Bottom 0.305: v128.91,1.91 128.91,3.49 129.86,4.45 133.67,4.45 134.62,5.4 JP6.8
PB0
  Bottom 0.305: IC1.1 103.19,39.37 104.46,38.1 106.36,38.1 107.31,39.05 115.89,39.05 116.84,38.1 145.73,38.1 149.86,33.97 153.03,37.15 153.35,37.15 153.67,37.47 JP8.1
  Bottom 0.406: IC1.1 102.87,41.91 99.06,45.72 SW4.7
PB1
  Bottom 0.305: JP8.3 152.4,41.27 152.4,37.47 149.86,34.92 146.05,38.73 117.16,38.73 116.2,39.69 105.41,39.69 104.46,40.64 104.46,49.85 102.23,52.07 97.16,52.07 96.52,51.44 SW4.6
  Bottom 0.406: IC1.2 100.33,41.91 96.52,45.72 SW4.6
PB2
  Bottom 0.305: JP8.5 152.4,43.81 149.86,43.81 145.41,39.37 117.47,39.37 116.52,40.32 105.73,40.32 105.09,40.96 105.09,50.16 102.55,52.7 96.2,52.7 94.3,50.8 94.3,49.85 SW4.5
  Bottom 0.406: IC1.3 97.79,41.91 93.98,45.72 SW4.5
PB3
  Bottom 0.305: JP8.7 152.4,46.35 144.46,46.35 144.15,46.04 144.15,40.01 117.79,40.01 116.84,40.96 106.05,40.96 105.73,41.27 105.73,50.48 102.87,53.34 94.61,53.34 91.76,50.48 91.76,49.85 SW4.4
  Bottom 0.406: IC1.4 95.25,41.91 91.44,45.72 SW4.4
PB4  (via drill 0.6)
  Top 0.305: IC1.5 92.71,42.55 93.66,43.5 106.05,43.5 107.63,41.91 131.13,41.91 132.72,43.5 138.75,43.5 142.24,40.01 146.05,40.01 148.27,37.78 v148.91,37.78
  Bottom 0.305: v148.91,37.78 JP8.2
  Bottom 0.406: IC1.5 92.71,41.91 88.9,45.72 SW4.3
PB5  (via drill 0.6, 0.6 pad 0.61)
  Top 0.305: v122.87,49.21 123.83,50.16 140.34,50.16 143.83,46.67 143.83,41.91 144.46,41.27 v148.91,41.27 | IC1.6 90.17,43.18 91.44,44.45 v107.95,44.45
  Top 0.406: 7.2 117.47,56.2 v117.79,55.88
  Bottom 0.305: 121.6,48.9 121.6,47.94 122.24,47.31 122.24,46.67 121.28,45.72 116.52,45.72 116.52,45.4 JP1.4 115.57,41.91 115.25,41.59 108.58,41.59 107.95,42.23 v107.95,44.45 | 121.6,48.9 121.6,52.07 | JP8.4 150.5,42.55 v148.91,41.27 | v122.87,49.21 121.92,49.21 121.6,48.9 | 86.36,44.45 90.17,40.64 IC1.6
  Bottom 0.406: 86.36,44.45 SW4.2 | 121.6,52.07 v117.79,55.88
PB6  (via drill 0.6, 0.6 pad 0.61)
  Top 0.305: 120.65,50.8 140.65,50.8 145.1,46.35 v145.1,45.09 | 87.63,45.09 90.17,47.62 90.17,53.66 90.81,54.29 105.09,54.29 v105.41,53.98 | v122.56,54.93 120.65,54.93
  Top 0.406: v120.65,49.21 120.65,50.8 120.65,54.93 8.2 | IC1.7 87.63,45.09
  Bottom 0.305: v145.1,45.09 JP8.6 | v105.41,53.98 105.41,58.1 106.05,58.74 118.75,58.74 v122.56,54.93 | JP1.1 118.11,48.26 119.06,49.21 v120.65,49.21
  Bottom 0.406: SW4.1 83.82,44.45 87.63,40.64 IC1.7
PB7  (via drill 0.6, 0.6 pad 0.61)
  Top 0.305: 114.62,55.88 114.62,55.24 113.67,54.29 110.49,54.29 110.17,53.98 | 110.17,53.98 109.86,53.66 109.86,50.16 110.49,49.53 v117.79,49.53 118.11,49.85 118.75,49.85 119.7,48.9 119.7,46.04 120.02,45.72 121.28,45.72 125.09,49.53 140.02,49.53 140.97,48.58 v140.97,47.62 | IC1.8 85.09,45.4 87.63,47.94 87.63,53.02 89.53,54.93 109.22,54.93 110.17,53.98
  Top 0.61: 114.62,55.88 6.2
  Bottom 0.305: v140.97,47.62 JP8.8
  Bottom 0.406: v117.79,49.53 115.57,47.31 JP1.3
PC0  (via drill 0.6)
  Top 0.305: v59.05,31.75 56.2,31.75 50.48,37.47 50.48,43.5 53.66,46.67 54.58,46.67 U$6.2
  Bottom 0.305: v59.05,31.75 57.15,29.84 IC1.22 57.15,23.81 61.59,19.37 69.22,19.37 71.44,17.14 87.95,17.14 88.9,16.19 SW3.8 88.9,13.34 89.85,12.38 90.49,12.38 92.08,10.79 96.2,10.79 96.84,10.16 98.11,10.16 99.69,8.57 108.58,8.57 110.81,6.35 110.81,4.76 111.76,3.81 119.38,3.81 JP2.7
PC1  (via drill 0.6)
  Top 0.305: v61.59,31.43 60.96,31.43 59.69,32.7 58.42,32.7 58.1,32.38 56.52,32.38 51.12,37.78 51.12,42.55 53.98,45.4 U$6.1
  Bottom 0.305: v61.59,31.43 59.69,29.53 IC1.23 59.69,22.86 62.55,20 69.53,20 71.75,17.78 89.53,17.78 91.44,15.88 SW3.7 91.44,13.34 92.71,12.06 94.3,12.06 94.93,11.43 96.52,11.43 97.16,10.79 98.42,10.79 100.01,9.21 109.22,9.21 111.76,6.67 111.76,5.08 112.39,4.45 117.47,4.45 JP2.5
PC2  (via drill 0.6)
  Top 0.305: IC1.24 62.23,23.18 60.96,21.91 54.29,21.91 52.7,23.5 52.7,25.08 52.07,25.72 43.81,25.72 42.23,24.13 35.24,24.13 v34.29,25.08
  Bottom 0.305: IC1.24 62.23,22.54 64.14,20.64 69.85,20.64 72.07,18.41 92.08,18.41 93.98,16.51 SW3.6 93.98,13.34 95.25,12.06 96.84,12.06 97.47,11.43 98.74,11.43 100.33,9.84 109.54,9.84 112.39,6.99 112.39,5.71 113.03,5.08 115.57,5.08 JP2.3 | v34.29,25.08 JP5.1
PC3  (via drill 0.6)
  Top 0.305: IC1.25 64.77,25.4 63.82,26.35 43.5,26.35 41.91,24.77 39.69,24.77 v39.05,25.4
  Bottom 0.305: IC1.25 64.77,22.86 66.36,21.27 70.17,21.27 72.39,19.05 94.3,19.05 96.52,16.83 SW3.5 96.52,13.34 97.79,12.06 99.06,12.06 100.65,10.48 110.17,10.48 JP2.1 | v39.05,25.4 39.05,30.16 JP5.5
PC4  (via drill 0.6)
  Top 0.305: IC1.26 67.31,25.72 66.04,26.99 v40.64,26.99
  Bottom 0.305: IC1.26 67.31,23.5 68.58,22.23 70.17,22.23 72.71,19.68 96.84,19.68 99.06,17.46 SW3.4 99.06,13.02 100.97,11.11 109.22,11.11 109.86,11.75 113.35,11.75 114.3,10.79 JP2.2 | JP5.3 36.83,27.94 36.83,24.13 37.15,23.81 39.37,23.81 40.64,25.08 v40.64,26.99
PC5  (via drill 0.6)
  Top 0.305: IC1.27 69.85,26.35 68.58,27.62 46.99,27.62 46.04,28.57 v46.04,29.53
  Bottom 0.305: IC1.27 69.85,23.5 73.03,20.32 98.11,20.32 101.6,16.83 SW3.3 101.6,13.02 102.87,11.75 108.27,11.75 108.9,12.38 116.2,12.38 116.84,11.75 JP2.4 | JP5.9 45.09,30.48 v46.04,29.53
PC6  (via drill 0.6)
  Top 0.305: 88.9,28.57 87.95,27.62 73.34,27.62 72.39,26.67
  Top 0.406: IC1.28 72.39,26.67 | 88.9,28.57 91.76,31.43 v104.46,31.43
  Bottom 0.305: SW3.2 104.14,13.02 104.78,12.38 107.63,12.38 108.58,13.34 118.43,13.34 119.38,12.38 JP2.6
  Bottom 0.406: SW1.4 110.17,31.43 v104.46,31.43 104.78,31.11 104.78,21.91 104.14,21.27 SW3.2
PC7  (via drill 0.6)
  Top 0.305: 89.53,27.94 88.58,26.99 75.88,26.99 74.93,26.04 IC1.29
  Top 0.406: 89.53,27.94 92.39,30.8 103.19,30.8 103.82,30.16 v106.36,30.16
  Bottom 0.305: SW3.1 120.97,13.97 121.92,13.02 JP2.8
  Bottom 0.406: SW1.3 112.71,30.16 111.76,29.21 108.58,29.21 107.63,30.16 v106.36,30.16 106.68,29.84 SW3.1
PD0
  Bottom 0.305: IC1.14 69.85,38.1 70.48,37.47 106.68,37.47 107.63,38.42 115.57,38.42 116.52,37.47 145.41,37.47 149.86,33.02 | 149.86,33.02 JP4.1 | SW11.4 140.97,54.61 142.24,53.34 155.89,53.34 156.84,52.39 156.84,37.78 155.57,36.51 153.35,36.51 149.86,33.02
PD1
  Bottom 0.305: IC1.15 67.31,38.42 68.9,36.83 107,36.83 107.95,37.78 115.25,37.78 116.2,36.83 145.1,36.83 148.91,33.02 148.91,29.84 149.22,29.53 JP4.3 150.81,30.48 151.13,30.8 151.45,30.8 152.08,31.43 152.08,34.29 153.67,35.88 155.89,35.88 157.48,37.47 157.48,52.7 156.21,53.98 142.88,53.98 141.92,54.93 141.92,56.52 141.6,56.83 138.43,56.83 137.16,55.56 SW11.3
PD2
  Bottom 0.305: SW19.8 20.32,16.19 23.81,19.68 37.47,19.68 37.78,20 38.1,20 46.99,28.89 46.99,38.73 51.44,43.18 62.87,43.18 64.77,41.27 IC1.16 64.77,38.73 67.31,36.2 107.31,36.2 108.27,37.15 114.94,37.15 115.89,36.2 144.78,36.2 147.96,33.02 147.96,27.62 148.59,26.99 JP4.5
PD3
  Bottom 0.305: SW19.7 22.86,16.19 25.72,19.05 38.1,19.05 47.62,28.57 47.62,38.42 51.75,42.55 60.96,42.55 62.23,41.27 IC1.17 62.23,38.73 63.5,37.47 64.77,37.47 66.67,35.56 107.63,35.56 108.58,36.51 114.62,36.51 115.57,35.56 144.46,35.56 147.32,32.7 147.32,25.08 147.96,24.45 JP4.7
PD4
  Bottom 0.305: SW19.6 25.4,15.88 27.94,18.41 38.42,18.41 48.26,28.26 48.26,38.1 52.07,41.91 58.74,41.91 59.69,40.96 IC1.18 59.69,38.73 61.59,36.83 64.45,36.83 66.36,34.92 107.95,34.92 108.9,35.88 114.3,35.88 115.25,34.92 144.15,34.92 146.69,32.38 146.69,24.45 147.96,23.18 151.76,23.18 152.08,23.5 152.08,30.16 153.03,31.11 153.03,31.75 JP4.2
PD5
  Bottom 0.305: SW19.5 27.94,15.24 30.48,17.78 38.73,17.78 48.9,27.94 48.9,37.78 52.39,41.27 56.2,41.27 57.15,40.32 IC1.19 57.15,38.42 58.42,37.15 60.33,37.15 61.28,36.2 64.14,36.2 66.04,34.29 108.27,34.29 109.22,35.24 113.98,35.24 114.94,34.29 143.83,34.29 146.05,32.07 146.05,24.13 147.96,22.23 147.96,19.68 148.27,19.37 149.86,19.37 150.5,20 155.89,20 156.53,20.64 156.53,28.57 155.57,29.53 153.99,29.53 | 153.99,29.53 JP4.4 | 153.99,29.53 154.62,29.53
PD6  (via drill 0.6)
  Top 0.305: v157.48,25.72 v155.26,25.72
  Bottom 0.305: IC1.20 54.61,39.05 56.52,37.15 57.47,37.15 58.1,36.51 60.01,36.51 60.96,35.56 63.82,35.56 65.72,33.66 108.58,33.66 109.54,34.61 113.67,34.61 114.62,33.66 143.51,33.66 145.41,31.75 145.41,23.81 147.32,21.91 147.32,19.37 147.96,18.73 150.18,18.73 150.81,19.37 156.21,19.37 157.48,20.64 v157.48,25.72 | JP4.6 153.67,26.67 154.31,26.67 v155.26,25.72
PD7  (via drill 0.6)
  Top 0.305: v155.26,18.1 v155.26,23.18 | v134.3,41.91 134.3,31.75 v134.62,31.43
  Bottom 0.305: IC1.21 54.61,29.21 58.42,33.02 108.9,33.02 109.86,33.97 113.35,33.97 114.3,33.02 134.94,33.02 | 134.94,33.02 143.19,33.02 144.78,31.43 144.78,23.5 146.69,21.59 146.69,18.73 147.32,18.1 150.5,18.1 151.13,18.73 154.62,18.73 v155.26,18.1 | JUM1.1 126.36,56.2 126.68,55.88 126.68,53.02 127,52.7 128.59,52.7 129.86,51.44 132.4,51.44 134.3,49.53 v134.3,41.91 | v134.62,31.43 134.62,32.7 134.94,33.02 | v155.26,23.18 155.26,23.81 154.62,24.45 JP4.8
RESET  (via drill 0.6, 0.6 pad 0.61)
  Top 0.305: IC1.9 82.55,43.18 81.6,44.13
  Top 0.406: 42.86,56.83 R3.1 | v41.59,38.42 42.86,39.69 | 55.88,56.83 57.15,56.83 57.47,56.52 66.04,56.52 66.36,56.2 81.6,56.2
  Top 0.61: 5.2 v111.76,56.2 105.09,56.2 104.46,56.83 104.46,58.42 103.5,59.37 82.55,59.37 81.6,58.42 81.6,56.2 81.6,52.07 | 81.6,52.07 81.6,44.13 | 81.6,52.07 81.28,51.75 | 42.86,39.69 42.86,56.83 55.88,56.83
  Bottom 0.406: v41.59,38.42 41.59,36.83 39.37,34.61 JP5.6
  Bottom 0.61: v111.76,56.2 111.76,53.34 JP9.3 | IC1.9 82.55,42.55 80.64,44.45 R20.1
RESETPRG  (via drill 0.6, 0.6 pad 0.81)
  Top 0.305: 49.53,71.12 48.9,71.75 47.55,71.75 U2.13 48.92,71.73 49.53,71.12 | 49.53,71.12 49.53,70.17 48.58,69.22 v48.26,69.22 | v76.52,61.59 104.78,61.59 106.68,59.69 v106.68,57.47
  Bottom 0.305: R14.1 43.31,72.89 46.99,69.22 v48.26,69.22 48.26,67.94 48.9,67.31 53.34,67.31 59.05,61.59 v76.52,61.59 | v106.68,57.47 113.35,57.47 118.11,52.7 JP9.1
VCC  (via drill 0.6, 0.6 pad 0.41, 0.6 pad 0.81)
  Top 0.305: U2.7 42.55,69.16 42.55,68.58 42.86,68.26 R3.2 42.86,64.45 42.23,63.82 41.27,63.82 v40.01,62.55 | U2.7 42.86,69.48 42.86,70.17 42.55,70.48 39.05,70.48 38.71,70.14 U2.2 38.71,70.19 38.42,70.48 37.78,70.48 | U2.7 42.7,70.32 43.18,70.8 45.72,70.8 46.04,71.12 46.04,72.07 46.35,72.39 47.37,72.39 U2.14 | 36.83,70.48 36.75,70.48 U2.44 36.37,70.94 36.83,70.48 | 37.78,70.48 36.83,70.48 | 37.78,70.48 37.78,71.75 37.15,72.39 36.45,72.39 U2.42 38.25,72.54 v38.42,72.71 37.78,73.34 37.78,78.11 | U2.34 37.29,78.92 37.78,78.42 37.78,78.11 | R15.2 R16.2 44.45,84.14 45.11,83.48 U2.24 45.11,79.4 44.45,78.74 38.42,78.74 37.78,78.11 | 58.55,19.82 R9.2 | 58.55,19.82 59.69,20.95 64.45,20.95 65.09,20.32 | 52.2,20.45 R8.2 | 52.2,20.45 52.7,20.95 57.41,20.95 58.55,19.82 | 45.85,19.82 R7.2 46.04,18.86 v46.04,16.19 | 45.85,19.82 46.67,20.64 52.01,20.64 52.2,20.45 | R6.2 39.5,19.5 40.96,20.95 44.71,20.95 45.85,19.82 | v148.91,20.32 148.91,17.46 v149.22,17.14 | 39.37,19.05 39.37,21.59 v38.42,22.54
  Top 0.406: 83.82,20.64 83.19,21.27 78.11,21.27 77.47,20.64 76.52,21.59 v75.88,21.59 75.25,20.95 72.39,20.95 65.72,20.95 65.09,20.32 65.09,19.24 R10.2 | v74.61,31.43 74.61,33.66 76.52,35.56 78.11,35.56 80.01,37.47 IC1.10 | v155.26,51.75 155.26,55.24 145.1,65.41 145.1,85.41 144.15,86.36 IC4.16 | 87,19.05 89.85,16.19 123.19,16.19 v127.32,12.06 | R11.2 71.25,19.68 71.75,19.68 arc90 72.39,20.32
  Top 0.61: U2.34 36.3,80.23 v33.97,82.55 | v120.02,40.96 120.02,32.07 v118.11,30.16 | v45.4,43.18 47.62,45.4 U$6.8 | 87,19.05 R13.2 83.95,20.51 83.82,20.64 | R12.2 77.47,19.18 77.47,20.64 | R11.2 72.39,20.19 72.39,20.32 72.39,20.95
  Bottom 0.305: v38.42,72.71 39.56,72.71 R14.2 C21.2 | JP5.4 36.83,31.75 40.96,31.75 41.91,30.8 JP5.7 41.91,29.21 43.5,27.62 43.5,26.67 42.55,25.72 42.23,25.72 39.05,22.54 v38.42,22.54 | 46.04,15.88 44.13,13.97 R24.1 | R25.1 52.2,14.47 51.28,15.4 | 51.28,15.4 51.12,15.56 46.35,15.56 46.04,15.88 | R26.1 62.36,14.47 61.28,15.56 | 61.28,15.56 51.44,15.56 51.28,15.4 | R27.1 72.52,14.47 71.44,15.56 61.28,15.56 | R21.1 125.6,49.08 120.65,44.13 | 120.65,44.13 118.43,44.13 JP1.2 | JP4.9 150.5,21.59 150.18,21.59 v148.91,20.32 | 120.65,44.13 120.65,41.59 v120.02,40.96 | 120.65,30.16 120.84,29.98 3.2 4.2 120.97,30.29 120.97,31.11 121.92,32.07 127,32.07 | v46.04,16.19 46.04,15.88
  Bottom 0.406: IC1.30 77.47,23.18 v75.88,21.59 | 76.83,29.84 76.52,30.16 76.52,31.11 C9.2 74.93,31.11 v74.61,31.43 | v155.26,51.75 JP8.9 | 127.32,7.3 v127.32,12.06
  Bottom 0.61: R23.2 14.61,44.45 15.74,43.31 R53.1 15.74,38.87 16.83,37.78 39.69,37.78 40.01,38.1 | IC1.30 77.47,26.99 | 77.47,26.99 77.47,29.21 76.83,29.84 | IC1.32 82.55,26.35 81.92,26.99 77.47,26.99 | 32.86,83.98 25.72,76.83 22.86,76.83 20,79.69 20,80.96 18.41,82.55 S1.2 | 32.86,83.98 46.99,98.11 91.76,98.11 93.09,96.78 X1.15 93.34,95.44 93.34,94.61 97.79,90.17 123.51,90.17 | v33.97,82.55 33.97,82.87 32.86,83.98 | 40.01,38.1 40.01,37.47 36.83,34.29 JP5.4 | 40.01,43.18 v40.01,62.55 | IC4.16 142.24,88.58 140.65,90.17 123.51,90.17 | JP2.9 126.36,6.35 127.32,7.3 128.91,8.89 JP6.9 132.08,15.88 133.35,17.14 143.19,17.14 | R21.1 125.6,55.06 123.51,57.15 123.51,90.17 | 143.19,17.14 v149.22,17.14 | v118.11,30.16 120.65,30.16 4.2 | 143.19,17.14 143.19,21.91 137.48,27.62 131.44,27.62 127,32.07 | 40.01,38.1 40.01,43.18 | 40.01,43.18 v45.4,43.18
VCCREG
  Bottom 0.61: C5.2 6.22,77.6 U1.3
  Bottom 0.813: U1.3 8.89,77.47 8.89,78.11 | 8.89,78.11 R5.2 | S1.3 22.86,83.19 20.64,85.41 17.78,85.41 17.14,84.77 17.14,80.33 17.14,78.74 16.83,78.42 9.21,78.42 8.89,78.11
VCCUSB  (via drill 0.6 pad 0.41)
  Top 0.305: X2.1 24.46,92.06 26.67,89.85
  Top 0.61: v28.57,89.85 26.67,89.85
  Bottom 0.61: C17.+ 33.02,93.98 31.75,92.71 31.75,89.35 C16.2 30.98,89.85 v28.57,89.85 18.1,89.85 15.56,87.31 15.24,87 S1.1
  Bottom 0.813: R17.2 15.05,87.82 15.56,87.31
VDD
  Bottom 0.305: X1.2 60.07,86.11 57.78,83.82 42.23,83.82 34.92,76.52 34.92,69.53 36.2,68.26 44.45,68.26 55.56,57.15 57.15,57.15 59.69,54.61 60.96,54.61 R1.2
VSS
  Bottom 0.305: X1.1 57.53,84.83 57.15,84.45 41.91,84.45 34.29,76.83 34.29,69.22 35.88,67.63 44.13,67.63 56.52,55.24 R1.1
  Bottom 0.406: R1.1 56.52,52.39 58.42,50.48 61.09,50.48 330.1
XTAL1  (via drill 0.6 pad 0.41)
  Top 0.305: U2.17 v50.16,74.93
  Bottom 0.305: v50.16,74.93 Q2.1
  Bottom 0.61: Q2.1 C18.2
XTAL2  (via drill 0.6 pad 0.41)
  Top 0.305: v50.16,73.34 49.85,73.34 49.21,73.98 47.69,73.98 U2.16
  Bottom 0.305: Q2.2 51.75,71.75 v50.16,73.34
  Bottom 0.61: Q2.2 C19.2

### Text on the board
tNames: USBmini | USB_pwr | LED00 | LED11 | PWR_LED | LCD HD44780 | DC input | USB supply | +5V | DC input | PC4 | PC4 | RS232 | PD7 | MMsystems | Display switches | Evaluation board | LCD | contrast | PRGRESET / RESET | PORTB | ADC potenciometers | PA0 | PA1 | RESET | Digital thermometer | GND | +5V | SCK | PB7 | PB3 | PC0 | RST | MISO | PC1 | PB6 | PB5 | PB4 | PB3 | PB2 | PB1 | PB0 | PB6 | PB2 | PB5 | PB1 | PORTD | PORTB | GND | MOSI | +5V | PB4 | PB0 | PA2 | PA4 | Piezo | GND | +5V | RST | GND | GND | ATmega | PORTD | PA4 | PD0 | PD4 | JTAG | PD1 | PD5 | TCK | TDO | TMS | +5V | TDI | PD2 | PD6 | PD3 | PD7 | ADC in | PORTC | PORTA | +5V | GND | PC6 | PC7 | Rotary encoder | PA2 | PC2 | PC3 | PC4 | PC5 | PC0 | PC1 | PC2 | PC3 | PC4 | PC5 | PC6 | PC7 | PC4 | PC5 | PC6 | PC7 | GND | +5V | PA3 | PA2 | PA1 | PA0 | PORTC | PORTA | Button switches | LED switches | PC3 | PC2 | PC1 | PC0 | +5V | GND | PA7 | PA6 | PA5 | PA4